# EAGLE design twinklr_board_5v (EAGLE 7.5.0)
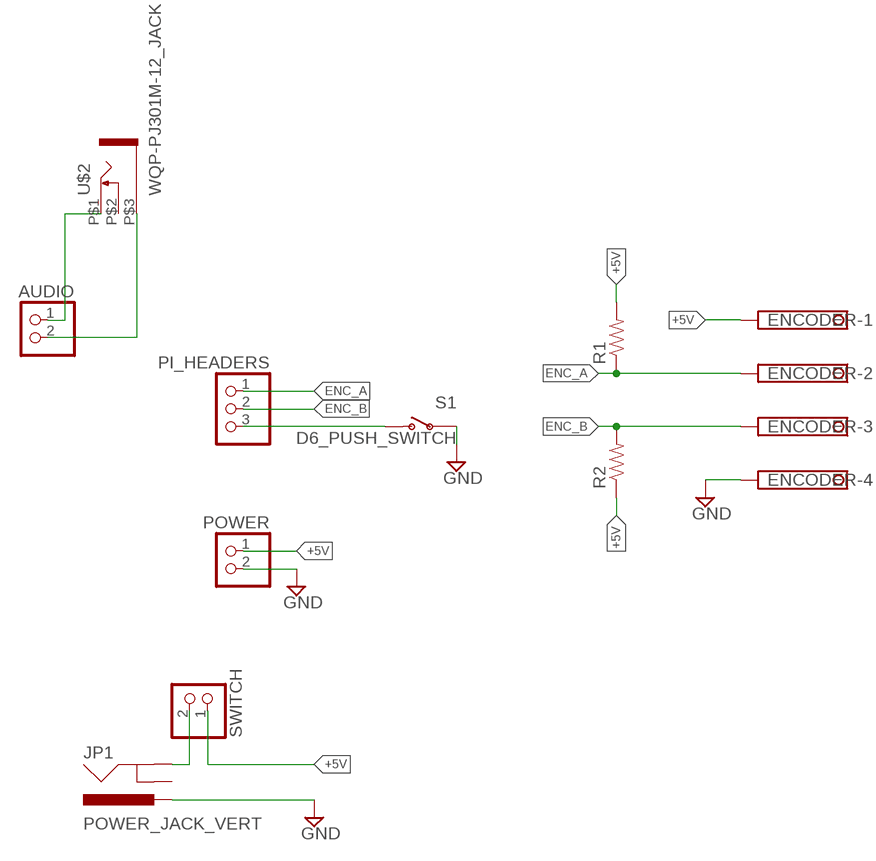
[diagram p0: schematic, sheet 1]

## Parts
AUDIO  PINHD-1X2  [1X02]
ENCODER  1751264  [1751264]
JP1  POWER_JACK_VERT  [POWER_JACK_VERT]
PI_HEADERS  PINHD-1X3  [1X03]
POWER  PINHD-1X2  [1X02]
R1  RESISTORAXIAL-0.3  [AXIAL-0.3]
R2  RESISTORAXIAL-0.3  [AXIAL-0.3]
S1  D6_PUSH_SWITCH  [D6_PUSH_SWITCH]
SWITCH  PINHD-1X2  [1X02]
U$2  WQP-PJ301M-12_JACK  [WQP-PJ301M-12_JACK]

## Nets
+5V: ENCODER.1 POWER.1 R1.P$2 R2.P$1 SWITCH.1
ENC_A: ENCODER.2 PI_HEADERS.1 R1.P$1
ENC_B: ENCODER.3 PI_HEADERS.2 R2.P$2
GND: ENCODER.4 JP1.PWR POWER.2 S1.P$3(P) S1.P$4(P)
N$1: AUDIO.2 U$2.P$3
N$2: AUDIO.1 U$2.P$1
N$11: JP1.GND SWITCH.2
N$13: PI_HEADERS.3 S1.P$1(O) S1.P$2(O)
Unconnected: JP1.GNDBREAK U$2.P$2

## Library data of the parts
AUDIO POWER SWITCH = pinhead:PINHD-1X2: PIN HEADER
ENCODER = con-phoenix-350:1751264: MKDS 1/ 4-3,5 Printklemme Nennstrom: 10 A Bemessungsspannung: 160 V Raster: 3,5 mm Polzahl: 4 Montageart: Löten Anschlussart: Schraubanschluss Anschlussrichtung vom Leiter zur Platine: 0° Source: http://eshop.phoenixcontact.com .. 1751264.pdf; MPN: 1751264; OC_FARNELL: unknown; OC_NEWARK: 10R0934
JP1 = foxfield:POWER_JACK_VERT: Power Jack This is the standard 5.5mm barrel jack for power. The PTH is the most common, proven, reliable, footprint. The Slot footprint only works if the mill layer is transmitted to the PCB fab house so be warned. Mating wall wart : TOL-00298 (and others)
PI_HEADERS = adafruit:PINHD-1X3: PIN HEADER
R1 R2 = SparkFun-Resistors:RESISTOR: Resistor Basic schematic elements and footprints for 0603, 1206, and PTH resistors.
S1 = MusicThingModular:D6_PUSH_SWITCH: Push switch
U$2 = thonkiconn:WQP-PJ301M-12_JACK

## Board
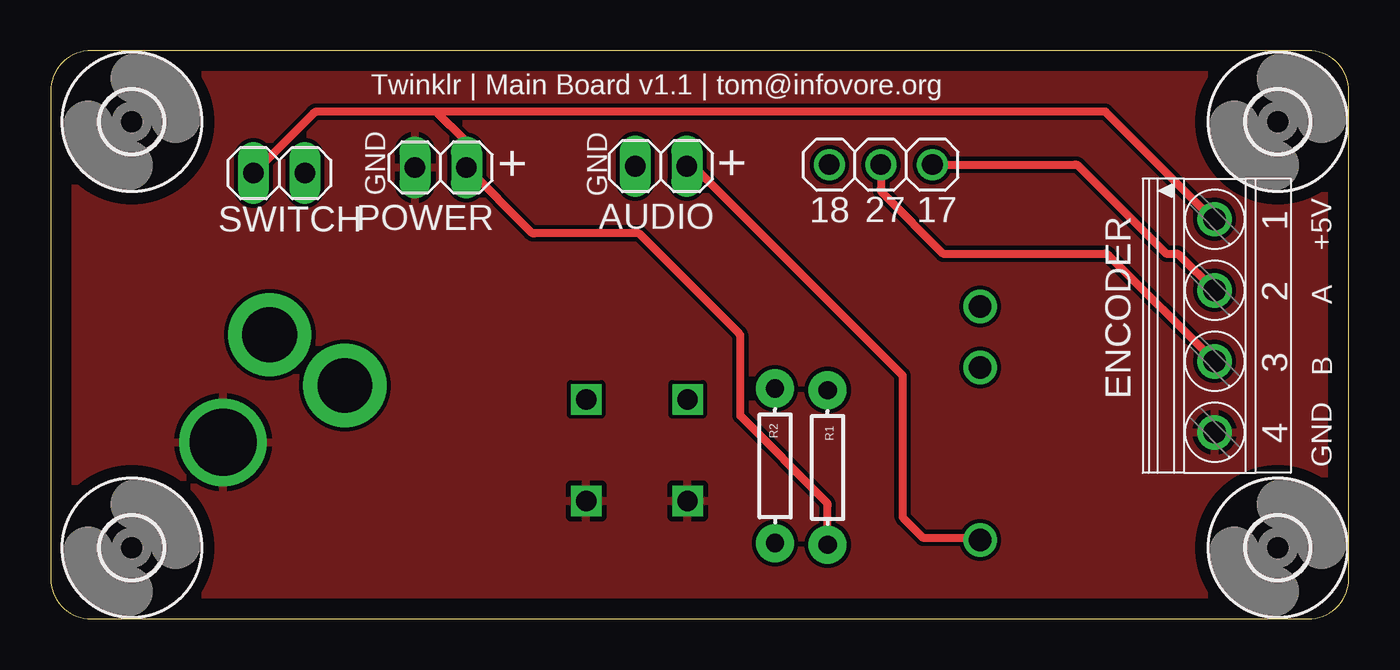
[diagram p1: board, top side]
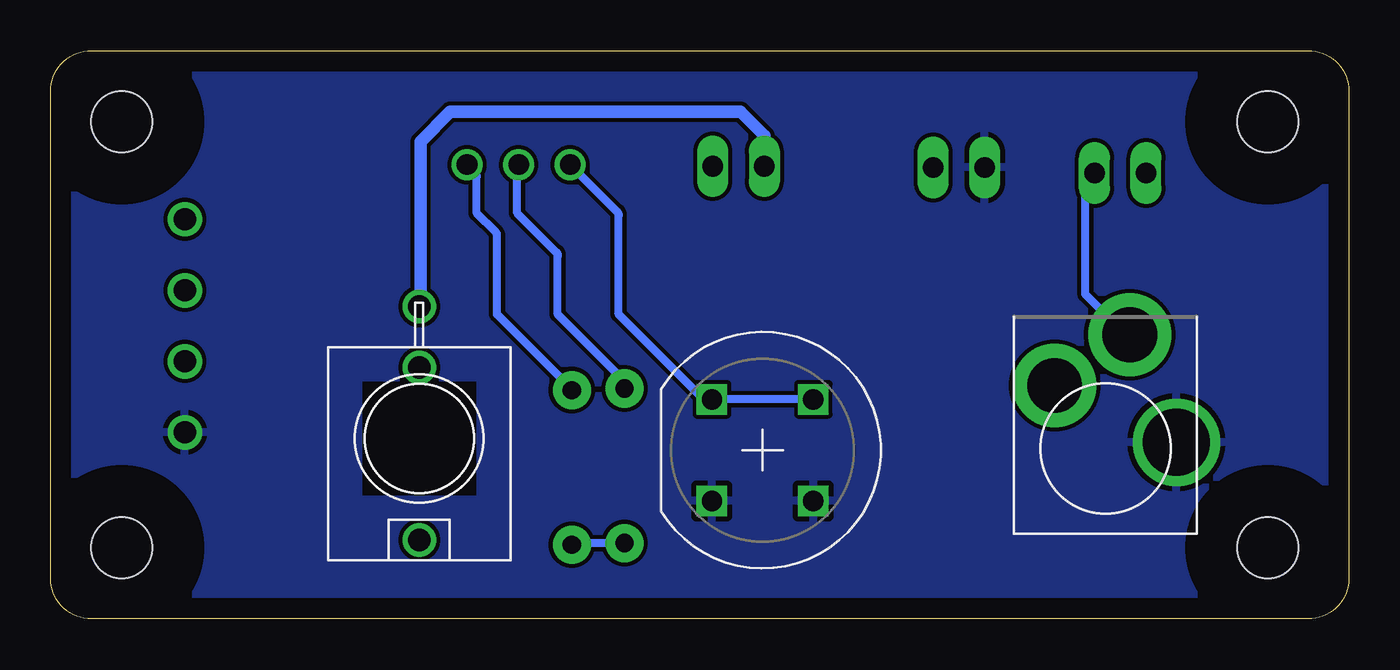
[diagram p2: board, bottom side, seen from below]

Size 64 x 28 mm. Coordinates in mm from the lower left corner, seen from the top.
Outline: 2,0 62,0 arc90 64,2 64,26 arc90 62,28 2,28 arc90 0,26 0,2 arc90 2,0
Copper layers (1*16): Top 0.035mm / dielectric 1.5mm / Bottom 0.035mm
Design rules "default": minimum track width 10mil, minimum drill 24mil, track to track 8mil, track to pad 8mil, pad to pad 8mil, via to via 8mil, smd to smd 8mil, copper to edge 40mil, drill to drill 8mil, minimum pad ring 10mil, minimum via ring 8mil, stop-mask expansion 4mil, vias tented up to drill 0mil, thermal gap 10mil

### Footprints (pad centres in the part's own frame; a part is rotated, then mirrored left to right if it is on the bottom)
1X02 = drill 1.016 long: 1 -1.27,0; 2 1.27,0
1751264 = drill 1.1 pad 1.7: 1 -5.25,-0.1; 2 -1.75,-0.1; 3 1.75,-0.1; 4 5.25,-0.1
POWER_JACK_VERT = drill 2.7 pad 4.1: GND -1.2,1; GNDBREAK 2.5,3.5 | drill 3.3 pad 4.3: PWR -3.5,6.3
1X03 = drill 1.016: 1 -2.54,0; 2 0,0; 3 2.54,0
AXIAL-0.3 = drill 0.9 pad 1.88: P$1 -3.81,0; P$2 3.81,0
D6_PUSH_SWITCH = drill 1 square: P$1 -2.5,2.5; P$2 2.5,2.5; P$3 2.5,-2.5; P$4 -2.5,-2.5
3,0 = hole 3: 0,0
WQP-PJ301M-12_JACK = drill 1.1: P$1 0,5; P$2 0,-3.5; P$3 0,-6.5

### Placement (x,y rotation side)
AUDIO  30.09,22.31 180 top
ENCODER  57.49,14.44 270 top
JP1  12,15 180 bottom
PI_HEADERS  40.93,22.38 180 top
POWER  19.22,22.25 180 top
R1  38.3,7.46 270 top
R2  35.71,7.54 90 top
S1  28.9,8.31 0 bottom
SWITCH  11.27,21.97 0 top
U$1  [3,0]  60.5,24.5 0 top
U$2  45.83,8.89 180 bottom
U$3  [3,0]  4,24.5 0 top
U$4  [3,0]  60.5,3.5 0 top
U$5  [3,0]  4,3.5 0 top

### Tracks (layer width: path | path; a pad name or v marks a point on that pad's centre or on a via)
+5V
  Top 0.406: R1.P$2 38.3,5.59 arc45 38.23,5.77 34,10 34,13.89 arc45 33.93,14.07 29,19 23.85,19 arc-45 23.67,19.07 POWER.1 20.49,23.4 arc45 20.42,23.58 19,25 | 19,25 13.14,25 arc45 12.96,24.93 SWITCH.1 | ENCODER.1 arc-45 57.25,19.75 52,25 19,25
  Bottom 0.406: R2.P$1 38.12,3.73 arc-45 R1.P$2
ENC_A
  Top 0.406: PI_HEADERS.1 50.51,22.38 arc-45 50.69,22.31 55,18 55.47,18 arc-45 55.65,17.93 ENCODER.2
  Bottom 0.406: R1.P$1 arc-45 38.33,11.33 42,15 42,18.89 arc-45 42.07,19.07 43,20 43,21.81 arc-45 43.07,21.99 PI_HEADERS.1
ENC_B
  Top 0.406: PI_HEADERS.2 40.93,21.18 arc45 41,21 44,18 51.97,18 arc-45 52.15,17.93 ENCODER.3
  Bottom 0.406: R2.P$2 35.71,11.61 arc-45 35.78,11.79 39,15 39,17.89 arc-45 39.07,18.07 41,20 41,22.21 arc45 PI_HEADERS.2
GND
  pour Bottom: 0,2 0,26 arc-90 2,28 62,28 arc-90 64,26 64,2 arc-90 62,0 2,0 arc-90
  pour Top: 2,0 62,0 arc90 64,2 64,26 arc90 62,28 2,28 arc90 0,26 0,2 arc90
N$1
  Bottom 0.61: AUDIO.2 28.82,23.82 30,25 44.3,25 45.77,23.52 45.77,15.45 U$2.P$3
N$2
  Top 0.406: AUDIO.1 31.59,22.31 arc-45 31.77,22.23 42,12 42,5.11 arc45 42.07,4.93 43,4 45.62,4 arc-45 45.79,3.93 U$2.P$1
N$11
  Bottom 0.406: JP1.GND 10.89,14 arc45 11.07,14.07 13,16 13,21.4 arc45 12.93,21.58 SWITCH.2
N$13
  Bottom 0.406: S1.P$2 S1.P$1 31.71,10.81 arc45 31.89,10.89 36,15 36,19.89 arc-45 36.07,20.07 PI_HEADERS.3

### Text on the board
tNames: Twinklr | Main Board v1.1 | tom@infovore.org | GND | + | GND | + | 18 | 27 | 17 | +5V | A | B | GND